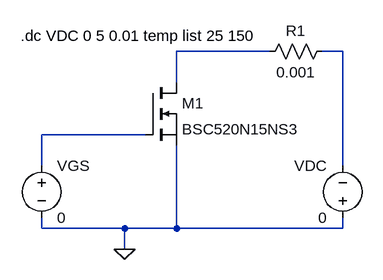
[diagram p0: schematic Forward characteristics of reverse diode.asc]
Forward characteristics of reverse diode.asc, the LTspice schematic file:
Version 4
SHEET 1 880 680
WIRE 320 32 176 32
WIRE 432 32 400 32
WIRE 176 80 176 32
WIRE 128 160 -32 160
WIRE -32 208 -32 160
WIRE 432 208 432 32
WIRE -32 304 -32 288
WIRE 96 304 -32 304
WIRE 176 304 176 176
WIRE 176 304 96 304
WIRE 432 304 432 288
WIRE 432 304 176 304
WIRE 96 336 96 304
FLAG 96 336 0
SYMBOL nmos 128 80 R0
SYMATTR InstName M1
SYMATTR Value BSC520N15NS3
SYMBOL voltage -32 192 R0
WINDOW 123 0 0 Left 2
WINDOW 39 0 0 Left 2
SYMATTR InstName VGS
SYMATTR Value 0
SYMBOL res 416 16 R90
WINDOW 0 0 56 VBottom 2
WINDOW 3 32 56 VTop 2
SYMATTR InstName R1
SYMATTR Value 0.001
SYMBOL voltage 432 304 R180
WINDOW 0 24 96 Left 2
WINDOW 3 24 16 Left 2
WINDOW 123 0 0 Left 2
WINDOW 39 0 0 Left 2
SYMATTR InstName VDC
SYMATTR Value 0
TEXT -64 8 Left 2 !.dc VDC 0 5 0.01 temp list 25 150

The netlist it stands for:
* Forward characteristics of reverse diode.asc
M1 N001 N003 0 0 BSC520N15NS3
VGS N003 0 0
R1 N002 N001 0.001
VDC 0 N002 0
.model NMOS NMOS
.model PMOS PMOS
.lib standard.mos
.dc VDC 0 5 0.01 temp list 25 150
.backanno
.end

* Results of the author's LTspice run, read from the files saved beside the schematic
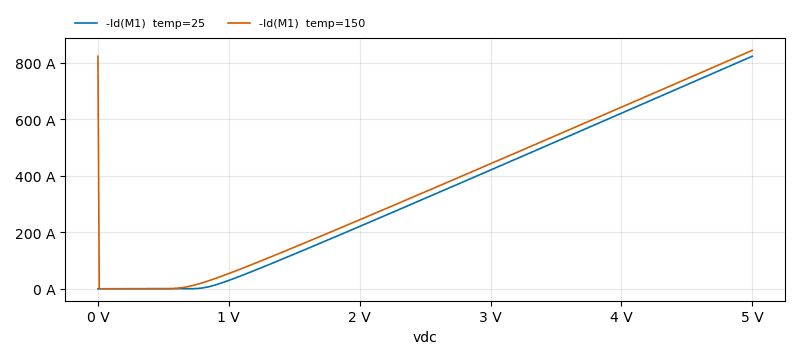
[diagram p1: DC transfer characteristic of Forward characteristics of reverse diode.asc, plotted from the saved traces]
* DC transfer characteristic, 2 runs:
*   -Id(M1) [temp=25]: -61.88 pA at vdc=0 V, 823.8 A at vdc=5 V, min -61.88 pA, max 823.8 A
*   -Id(M1) [temp=150]: 823.8 A at vdc=0 V, 844.6 A at vdc=5 V, min 584.1 nA, max 844.6 A